# EAGLE design Board_v2_5 (EAGLE 9.6.2)
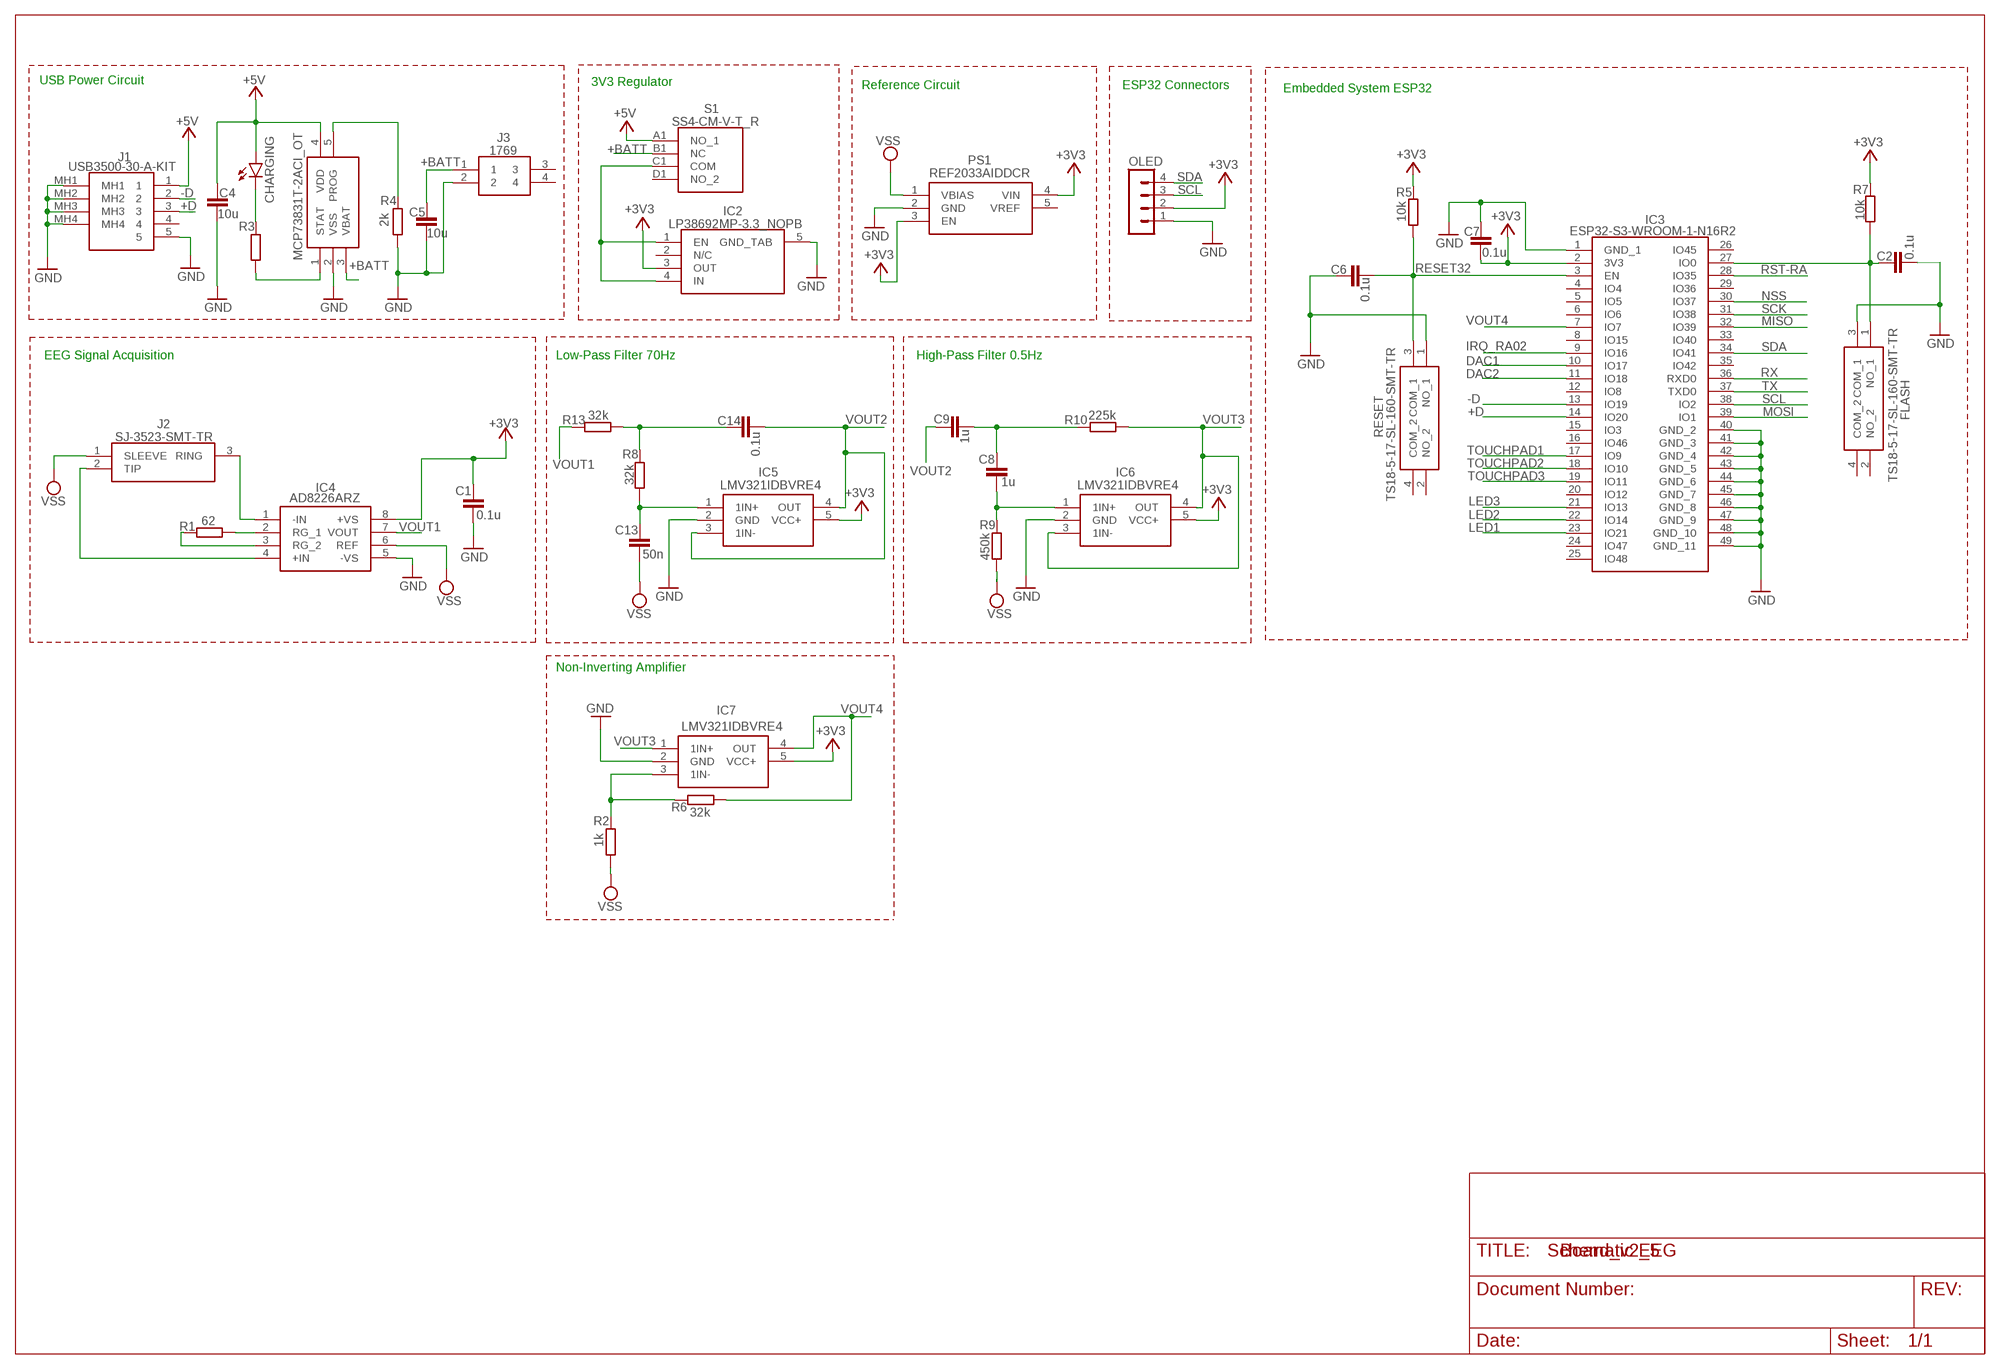
[diagram p0: schematic, sheet 1]

## Parts
C1  0.1u  C-EUC0805  [C0805]
C2  0.1u  C-EUC0805  [C0805]
C4  10u  C-EUC0805  [C0805]
C5  10u  C-EUC0805  [C0805]
C6  0.1u  C-EUC0805  [C0805]
C7  0.1u  C-EUC0805  [C0805]
C8  1u  C-EUC0805  [C0805]
C9  1u  C-EUC0805  [C0805]
C13  50n  C-EUC0805  [C0805]
C14  0.1u  C-EUC0805  [C0805]
CHARGING  LEDCHIP-LED0805  [CHIP-LED0805]
FLASH  TS18-5-17-SL-160-SMT-TR  [TS18517SL160SMTTR]
IC1  MCP73831T-2ACI_OT  [SOT95P270X145-5N]
IC2  LP38692MP-3.3_NOPB  [SOT150P700X180-5N]
IC3  ESP32-S3-WROOM-1-N16R2  [ESP32S3WROOM1N16R2]
IC4  AD8226ARZ  [SOIC127P600X175-8N]
IC5  LMV321IDBVRE4  [SOT95P280X145-5N]
IC6  LMV321IDBVRE4  [SOT95P280X145-5N]
IC7  LMV321IDBVRE4  [SOT95P280X145-5N]
J1  USB3500-30-A-KIT  [USB350030AKIT]
J2  SJ-3523-SMT-TR  [SJ3523SMTTR]
J3  1769  [1769]
OLED  MA04-1  [MA04-1]
PS1  REF2033AIDDCR  [SOT95P280X110-5N]
R1  62  R-EU_R0805  [R0805]
R2  1k  R-EU_R0805  [R0805]
R3  220  R-EU_R0805  [R0805]
R4  2k  R-EU_R0805  [R0805]
R5  10k  R-EU_R0805  [R0805]
R6  32k  R-EU_R0805  [R0805]
R7  10k  R-EU_R0805  [R0805]
R8  32k  R-EU_R0805  [R0805]
R9  450k  R-EU_R0805  [R0805]
R10  225k  R-EU_R0805  [R0805]
R13  32k  R-EU_R0805  [R0805]
RESET  TS18-5-17-SL-160-SMT-TR  [TS18517SL160SMTTR]
S1  SS4-CM-V-T_R  [SS4CMVTR]

## Nets
+3V3: C1.1 C7.2 IC2.3(OUT) IC3.2(3V3) IC4.8(+VS) IC5.5(VCC+) IC6.5(VCC+) IC7.5(VCC+) OLED.2 PS1.3(EN) PS1.4(VIN) R5.2 R7.2
+5V: J1.1 S1.A1(NO_1)
+BATT: C5.2 IC1.3(VBAT) J3.1 S1.B1(NC)
+D: IC3.14(IO20) J1.3
-D: IC3.13(IO19) J1.2
DAC1: IC3.10(IO17)
DAC2: IC3.11(IO18)
GND: C1.2 C2.2 C4.1 C5.1 C6.1 C7.1 FLASH.3(COM_1) IC1.2(VSS) IC2.5(GND_TAB) IC3.1(GND_1) IC3.40(GND_2) IC3.41(GND_3) IC3.42(GND_4) IC3.43(GND_5) IC3.44(GND_6) IC3.45(GND_7) IC3.46(GND_8) IC3.47(GND_9) IC3.48(GND_10) IC3.49(GND_11) IC4.5(-VS) IC5.2(GND) IC6.2(GND) IC7.2(GND) J1.5 J1.MH1 J1.MH2 J1.MH3 J1.MH4 J3.2 OLED.1 PS1.2(GND) R4.1 RESET.1(NO_1)
IRQ_RA02: IC3.9(IO16)
LED1: IC3.23(IO21)
LED2: IC3.22(IO14)
LED3: IC3.21(IO13)
MISO: IC3.32(IO39)
MOSI: IC3.39(IO1)
N$1: IC4.2(RG_1) R1.2
N$2: IC4.3(RG_2) R1.1
N$3: IC4.1(-IN) J2.3(RING)
N$4: IC4.4(+IN) J2.2(TIP)
N$5: C8.2 IC6.1(1IN+) R9.2
N$6: IC1.1(STAT) R3.1
N$7: IC1.5(PROG) R4.2
N$8: CHARGING.C R3.2
N$9: C8.1 C9.2 R10.1
N$10: C2.1 FLASH.1(NO_1) IC3.27(IO0) R7.1
N$11: C13.1 IC5.1(1IN+) R8.1
N$13: IC2.1(EN) IC2.4(IN) S1.C1(COM)
N$14: IC7.3(1IN-) R2.2 R6.2
N$15: C4.2 CHARGING.A IC1.4(VDD)
N$17: C14.1 R8.2 R13.2
NSS: IC3.30(IO37)
RESET32: C6.2 IC3.3(EN) R5.1 RESET.3(COM_1)
RST-RA: IC3.28(IO35)
RX: IC3.36(RXD0)
SCK: IC3.31(IO38)
SCL: IC3.38(IO2) OLED.3
SDA: IC3.34(IO41) OLED.4
TOUCHPAD1: IC3.17(IO9)
TOUCHPAD2: IC3.18(IO10)
TOUCHPAD3: IC3.19(IO11)
TX: IC3.37(TXD0)
VOUT1: IC4.7(VOUT) R13.1
VOUT2: C9.1 C14.2 IC5.3(1IN-) IC5.4(OUT)
VOUT3: IC6.3(1IN-) IC6.4(OUT) IC7.1(1IN+) R10.2
VOUT4: IC3.7(IO7) IC7.4(OUT) R6.1
VSS: C13.2 IC4.6(REF) J2.1(SLEEVE) PS1.1(VBIAS) R2.1 R9.1
Unconnected: FLASH.2(NO_2) FLASH.4(COM_2) IC2.2(N/C) IC3.4(IO4) IC3.5(IO5) IC3.6(IO6) IC3.8(IO15) IC3.12(IO8) IC3.15(IO3) IC3.16(IO46) IC3.20(IO12) IC3.24(IO47) IC3.25(IO48) IC3.26(IO45) IC3.29(IO36) IC3.33(IO40) IC3.35(IO42) J1.4 J3.3 J3.4 PS1.5(VREF) RESET.2(NO_2) RESET.4(COM_2) S1.D1(NO_2)

## Notes on the sheet
- USB Power Circuit | 3V3 Regulator
- Reference Circuit | ESP32 Connectors | Embedded System ESP32
- EEG Signal Acquisition | Low-Pass Filter 70Hz | High-Pass Filter 0.5Hz
- Non-Inverting Amplifier
- Schematic EEG

## Library data of the parts
C1 C2 C4-C9 C13 C14 = rcl:C-EU: CAPACITOR, European symbol; SPICEPREFIX: C
CHARGING = led:LED: LED OSRAM: - CHIPLED LG R971, LG N971, LY N971, LG Q971, LY Q971, LO R971, LY R971 LH N974, LH R974 LS Q976, LO Q976, LY Q976 LO Q996 - Hyper CHIPLED LW Q18S LB Q993, LB Q99A, LB R99A - SideLED LS A670, LO A670, LY A670, LG A670, LP A670 LB A673, LV A673, LT A673, LW A673 LH A674 LY A675 LS A676, LA A676, LO A676, LY A676, LW A676 LS A679, LY A679, LG A679 - Hyper Micro SIDELED® LS Y876, LA Y876, LO Y876, LY Y876 LT Y87S - SmartLED LW L88C, LW L88S LB L89C, LB L89S, LG L890 LS L89K, LO L89K, LY L89K LS L896, LA L896, LO L896, LY L896 - TOPLED LS T670, LO T670, LY T670, LG T670, LP T670 LSG T670, LSP T670, LSY T670, LOP T670, LYG T670 LG T671, LOG T671, LSG T671 LB T673, LV T673, LT T673, LW T673 LH T674 LS T676, LA T676, LO T676, LY T676, LB T676, LH T676, LSB T676, LW T676 LB T67C, LV T67C, LT T67C, LS T67K, LO T67K, LY T67K, LW E67C LS E67B, LA E67B, LO E67B, LY E67B, LB E67C, LV E67C, LT E67C LW T67C LS T679, LY T679, LG T679 LS T770, LO T770, LY T770, LG T770, LP T770 LB T773, LV T773, LT T773, LW T773 LH T774 LS E675, LA E675, LY E675, LS T675 LS T776, LA T776, LO T776, LY T776, LB T776 LHGB T686 LT T68C, LB T68C - Hyper Mini TOPLED® LB M676 - Mini TOPLED Santana® LG M470 LS M47K, LO M47K, LY M47K Source: http://www.osram.convergy.de LUXEON: - LUMILED® LXK2-PW12-R00, LXK2-PW12-S00, LXK2-PW14-U00, LXK2-PW14-V00 LXK2-PM12-R00, LXK2-PM12-S00, LXK2-PM14-U00 LXK2-PE12-Q00, LXK2-PE12-R00, LXK2-PE12-S00, LXK2-PE14-T00, LXK2-PE14-U00 LXK2-PB12-K00, LXK2-PB12-L00, LXK2-PB12-M00, LXK2-PB14-N00, LXK2-PB14-P00, LXK2-PB14-Q00 LXK2-PR12-L00, LXK2-PR12-M00, LXK2-PR14-Q00, LXK2-PR14-R00 LXK2-PD12-Q00, LXK2-PD12-R00, LXK2-PD12-S00 LXK2-PH12-R00, LXK2-PH12-S00 LXK2-PL12-P00, LXK2-PL12-Q00, LXK2-PL12-R00 Source: www.luxeon.com KINGBRIGHT: KA-3528ASYC Source: www.kingbright.com
FLASH RESET = TS18-5-17-SL-160-SMT-TR:TS18-5-17-SL-160-SMT-TR: 5 x 5 mm, 1.7 mm Actuator Height, 160 gf, Silver, Surface Mount, TR, SPST, Tactile Switch Source: Datasheet <https://www.sameskydevices.com/product/resource/supplyframepdf/ts18.pdf>; DESCRIPTION: 5 x 5 mm, 1.7 mm Actuator Height, 160 gf, Silver, Surface Mount, TR, SPST, Tactile Switch; HEIGHT: 1.8mm; MANUFACTURER_NAME: Same Sky; MANUFACTURER_PART_NUMBER: TS18-5-17-SL-160-SMT-TR; MOUSER_PART_NUMBER: 179-TS18517SL160SMTT; MOUSER_PRICE-STOCK: https://www.mouser.co.uk/ProductDetail/CUI-Devices/TS18-5-17-SL-160-SMT-TR?qs=tlsG%2FOw5FFhWy38y3t272A%3D%3D
IC1 = MCP73831T-2ACI_OT:MCP73831T-2ACI_OT: Li-Ion Charge Controller 4.2V SOT23-5 Source: Datasheet <http://ww1.microchip.com/downloads/en/DeviceDoc/20001984g.pdf>; ARROW_PART_NUMBER: MCP73831T-2ACI/OT; ARROW_PRICE-STOCK: https://www.arrow.com/en/products/mcp73831t-2aciot/microchip-technology?utm_currency=USD&region=nac; DESCRIPTION: Li-Ion Charge Controller 4.2V SOT23-5; HEIGHT: 1.45mm; MANUFACTURER_NAME: Microchip; MANUFACTURER_PART_NUMBER: MCP73831T-2ACI/OT; MOUSER_PART_NUMBER: 579-MCP73831T-2ACIOT; MOUSER_PRICE-STOCK: https://www.mouser.co.uk/ProductDetail/Microchip-Technology/MCP73831T-2ACI-OT?qs=yUQqVecv4qvbBQBGbHx0Mw%3D%3D
IC2 = LP38692MP-3.3_NOPB:LP38692MP-3.3_NOPB: LP38692MP-3.3/NOPB, Low Dropout Voltage Regulator, 1A, 3.3 V +/-2.5%, 2.7 10 Vin, 5-Pin SOT-223 Source: Datasheet <http://www.ti.com/lit/ds/symlink/lp38692.pdf>; DESCRIPTION: LP38692MP-3.3/NOPB, Low Dropout Voltage Regulator, 1A, 3.3 V +/-2.5%, 2.7 10 Vin, 5-Pin SOT-223; HEIGHT: 1.8mm; MANUFACTURER_NAME: Texas Instruments; MANUFACTURER_PART_NUMBER: LP38692MP-3.3/NOPB; MOUSER_PART_NUMBER: 926-LP38692MP3.3NOPB; MOUSER_PRICE-STOCK: https://www.mouser.co.uk/ProductDetail/Texas-Instruments/LP38692MP-3.3-NOPB?qs=1FNqv8aZn1TpKuOP2NKBdg%3D%3D
IC3 = ESP32-S3-WROOM-1-N16R2:ESP32-S3-WROOM-1-N16R2: Bluetooth, WiFi 802.11b/g/n, Bluetooth v5.0 Transceiver Module 2.4GHz PCB Trace Surface Mount , 3V ~ 3.6V , 95mA ~ 97mA , -40C ~ 85C (TA) Source: Datasheet <https://www.espressif.com/sites/default/files/documentation/esp32-s3-wroom-1_wroom-1u_datasheet_en.pdf>; DESCRIPTION: Bluetooth, WiFi 802.11b/g/n, Bluetooth v5.0 Transceiver Module 2.4GHz PCB Trace Surface Mount , 3V ~ 3.6V , 95mA ~ 97mA , -40C ~ 85C (TA); HEIGHT: 3.25mm; MANUFACTURER_NAME: Espressif Systems; MANUFACTURER_PART_NUMBER: ESP32-S3-WROOM-1-N16R2; MOUSER_PART_NUMBER: 356-ESP32S3WRM1N16R2; MOUSER_PRICE-STOCK: https://www.mouser.co.uk/ProductDetail/Espressif-Systems/ESP32-S3-WROOM-1-N16R2?qs=Li%252BoUPsLEnvy1bxV65eH%2Fw%3D%3D
IC4 = AD8226ARZ:AD8226ARZ: Wide Supply Range, Rail-to-Rail Output Instrumentation Amplifier Source: Datasheet <http://componentsearchengine.com/Datasheets/3/AD8226ARZ.pdf>; DESCRIPTION: Wide Supply Range, Rail-to-Rail Output Instrumentation Amplifier; HEIGHT: 1.75mm; MANUFACTURER_NAME: Analog Devices; MANUFACTURER_PART_NUMBER: AD8226ARZ; MOUSER_PART_NUMBER: 584-AD8226ARZ; MOUSER_PRICE-STOCK: https://www.mouser.co.uk/ProductDetail/Analog-Devices/AD8226ARZ?qs=%2FtpEQrCGXCzihJADRPlhCg%3D%3D
IC5-IC7 = LMV321IDBVRE4:LMV321IDBVRE4: OP Amp Single GP R-R O/P 5.5V 5-Pin SOT-23 T/R Source: Datasheet <https://www.ti.com/lit/ds/symlink/lmv321.pdf?ts=1639294341048&ref_url=https%3A%2F%2Fwww.ti.com%2Fstore%2Fti%2Fen%2Fp%2Fproduct%2F%3Fp%3DLMV321IDBVR>; DESCRIPTION: OP Amp Single GP R-R O/P 5.5V 5-Pin SOT-23 T/R; HEIGHT: 1.45mm; MANUFACTURER_NAME: Texas Instruments; MANUFACTURER_PART_NUMBER: LMV321IDBVRE4; MOUSER_PART_NUMBER: 595-LMV321IDBVRE4; MOUSER_PRICE-STOCK: https://www.mouser.co.uk/ProductDetail/Texas-Instruments/LMV321IDBVRE4?qs=yhNIDeTE%252BcaI6cu5FHph6A%3D%3D
J1 = USB3500-30-A-KIT:USB3500-30-A-KIT: USB Connectors Micro B Skt, Mid Mount-SMT, R/A, 30u", With Peg, T&R, IP67 + USBTJ-02 Gasket Source: Datasheet <https://gct.co/files/drawings/usb3500.pdf>; DESCRIPTION: USB Connectors Micro B Skt, Mid Mount-SMT, R/A, 30u", With Peg, T&R, IP67 + USBTJ-02 Gasket; HEIGHT: 2.8mm; MANUFACTURER_NAME: GCT (GLOBAL CONNECTOR TECHNOLOGY); MANUFACTURER_PART_NUMBER: USB3500-30-A-KIT; MOUSER_PART_NUMBER: 640-USB3500-30-A-KIT; MOUSER_PRICE-STOCK: https://www.mouser.co.uk/ProductDetail/GCT/USB3500-30-A-KIT?qs=KUoIvG%2F9IlZmD2kH2DfgYg%3D%3D
J2 = SJ-3523-SMT-TR:SJ-3523-SMT-TR: 3.5 mm, Stereo, Right Angle, Surface Mount (SMT), 3 Conductors, 0 Internal Switches, Audio Jack Connector Source: Datasheet <https://www.sameskydevices.com/product/resource/supplyframepdf/sj-352x-smt.pdf>; DESCRIPTION: 3.5 mm, Stereo, Right Angle, Surface Mount (SMT), 3 Conductors, 0 Internal Switches, Audio Jack Connector; HEIGHT: 5.2mm; MANUFACTURER_NAME: Same Sky; MANUFACTURER_PART_NUMBER: SJ-3523-SMT-TR; MOUSER_PART_NUMBER: 490-SJ-3523-SMT-TR; MOUSER_PRICE-STOCK: https://www.mouser.co.uk/ProductDetail/CUI-Devices/SJ-3523-SMT-TR?qs=WyjlAZoYn51zOHzJ3r4ZRA%3D%3D
J3 = 1769:1769: Adafruit Accessories JST-PH 2-pin SMT Right Angle Connect Source: Datasheet <https://cdn-shop.adafruit.com/datasheets/17311.pdf>; ARROW_PART_NUMBER: 1769; ARROW_PRICE-STOCK: https://www.arrow.com/en/products/1769/adafruit-industries?utm_currency=USD&region=nac; DESCRIPTION: Adafruit Accessories JST-PH 2-pin SMT Right Angle Connect; HEIGHT: 5.5mm; MANUFACTURER_NAME: Adafruit; MANUFACTURER_PART_NUMBER: 1769; MOUSER_PART_NUMBER: 485-1769; MOUSER_PRICE-STOCK: https://www.mouser.co.uk/ProductDetail/Adafruit/1769?qs=GURawfaeGuBbgoGtf2XstA%3D%3D
OLED = con-lstb:MA04-1: PIN HEADER; OC_FARNELL: unknown; OC_NEWARK: unknown
PS1 = REF2033AIDDCR:REF2033AIDDCR: Low-Drift, Low-Power, Dual-Output Vref and Vref/2 Voltage Reference Source: Datasheet <http://www.ti.com/lit/ds/symlink/ref2033.pdf>; DESCRIPTION: Low-Drift, Low-Power, Dual-Output Vref and Vref/2 Voltage Reference; HEIGHT: 1.1mm; MANUFACTURER_NAME: Texas Instruments; MANUFACTURER_PART_NUMBER: REF2033AIDDCR; MOUSER_PART_NUMBER: 595-REF2033AIDDCR; MOUSER_PRICE-STOCK: https://www.mouser.co.uk/ProductDetail/Texas-Instruments/REF2033AIDDCR?qs=7z%252BmIopC6%2FKHHOBVNaL7UQ%3D%3D
R1-R10 R13 = rcl:R-EU_: RESISTOR, European symbol; SPICEPREFIX: R
S1 = SS4-CM-V-T_R:SS4-CM-V-T_R: Slide Switches Slide Type 1P3T (2.0mm height) Source: Datasheet <https://componentsearchengine.com/Datasheets/1/SS4-CM-V-T_R.pdf>; DESCRIPTION: Slide Switches Slide Type 1P3T (2.0mm height); HEIGHT: 2mm; MANUFACTURER_NAME: Diptronics; MANUFACTURER_PART_NUMBER: SS4-CM-V-T/R; MOUSER_PART_NUMBER: 113-SS4CMVTR; MOUSER_PRICE-STOCK: https://www.mouser.co.uk/ProductDetail/Diptronics/SS4-CM-V-T-R?qs=MLItCLRbWswqNEU%2F6grMKg%3D%3D

## Net classes
0 default: clearance 0.205 mm

## Board
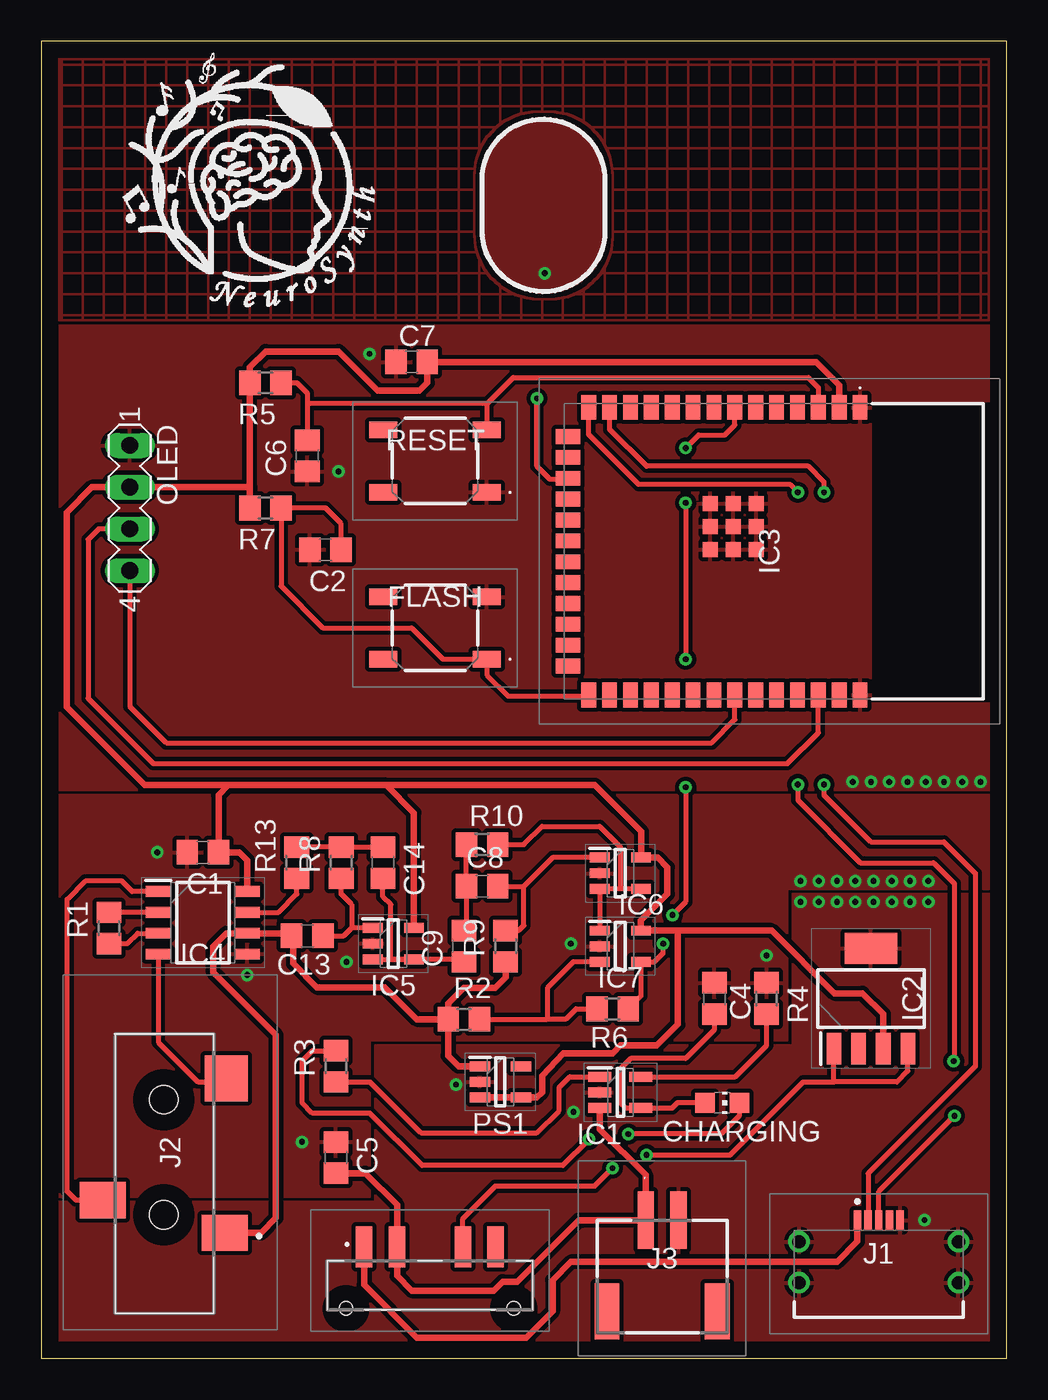
[diagram p1: board, top side]
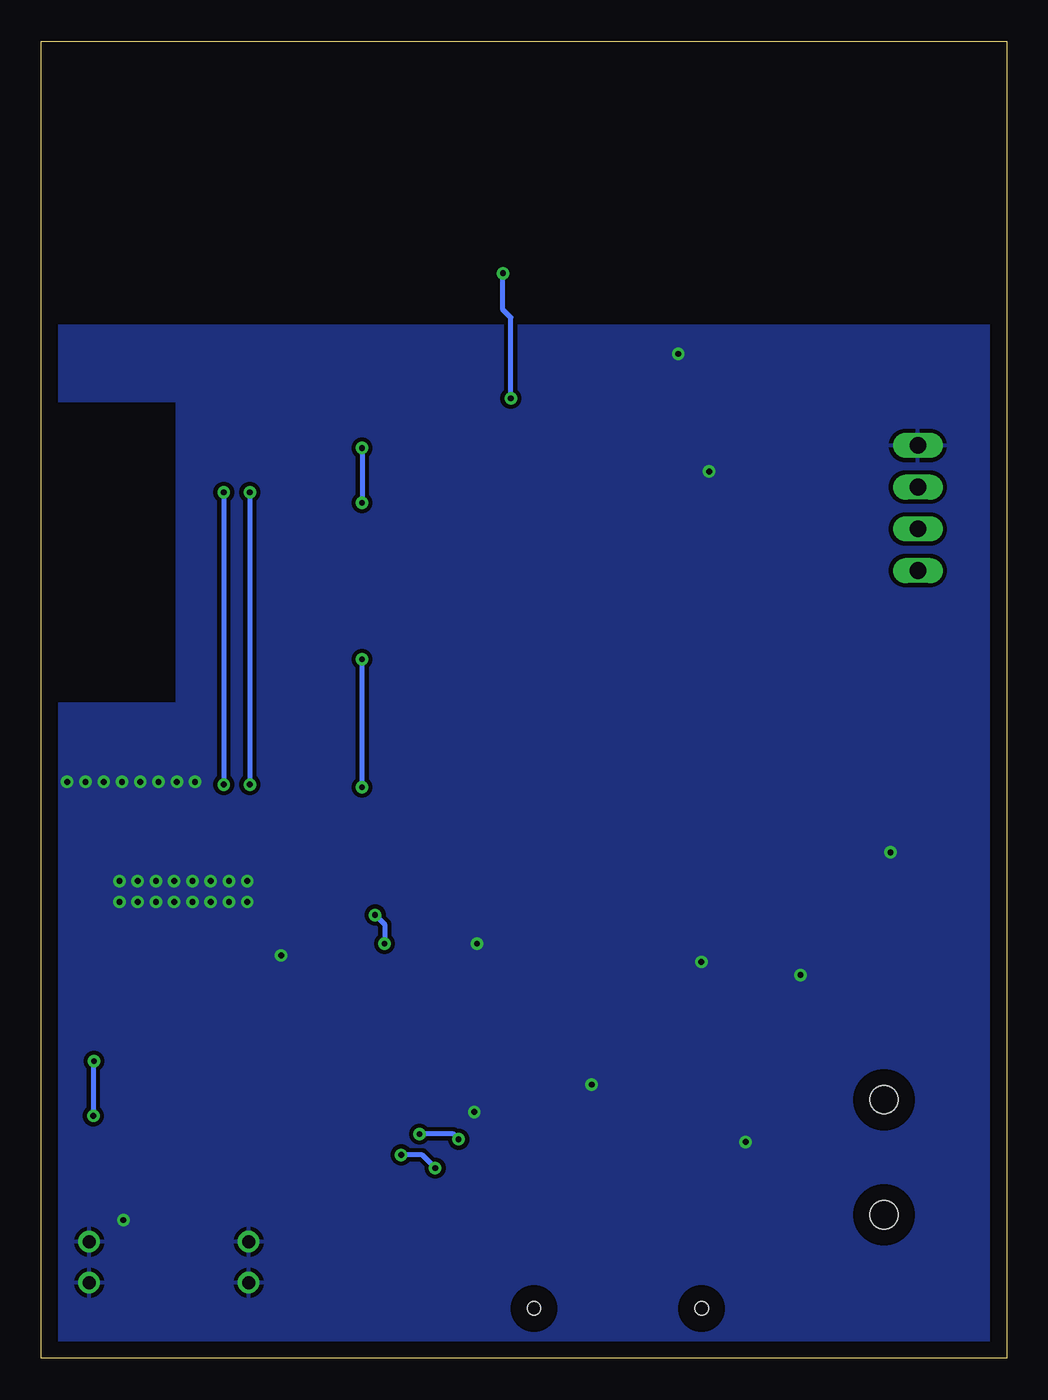
[diagram p2: board, bottom side, seen from below]

Size 58.74 x 80.17 mm. Coordinates in mm from the lower left corner, seen from the top.
Outline: 0,0 58.73,0 58.73,1.1 58.74,10.79 58.74,80.17 58.42,80.17 58.41,80.17 0,80.17 0,0
Copper layers (1*16): Top 0.035mm / dielectric 1.5mm / Bottom 0.035mm
Design rules "Board_v1_4": minimum track width 6mil, minimum drill 0.35mm, track to track 0.205mm, track to pad 0.205mm, pad to pad 0.205mm, via to via 0.205mm, smd to smd 6mil, copper to edge 40mil, drill to drill 6mil, minimum pad ring 10mil, minimum via ring 8mil, stop-mask expansion 4mil, vias tented up to drill 0mil, thermal gap 10mil

### Footprints (pad centres in the part's own frame; a part is rotated, then mirrored left to right if it is on the bottom)
C0805 = smd 1.3 x 1.5: 1 -0.95,0; 2 0.95,0
CHIP-LED0805 = smd 1.2 x 1.2: A 0,-1.05; C 0,1.05
TS18517SL160SMTTR = smd 1.7 x 1: 1 -3.15,1.9; 2 3.15,1.9; 3 -3.15,-1.9; 4 3.15,-1.9
SOT95P270X145-5N = smd 1.4 x 0.6: 1 -1.25,0.95; 2 -1.25,0; 3 -1.25,-0.95; 4 1.25,-0.95; 5 1.25,0.95
SOT150P700X180-5N = smd 1.9 x 0.9: 1 -3.05,2.25; 2 -3.05,0.75; 3 -3.05,-0.75; 4 -3.05,-2.25 | smd 1.9 x 3.2: 5 3.05,0
ESP32S3WROOM1N16R2 = smd 1.5 x 0.9: 1 -8.75,5.26; 2 -8.75,3.99; 3 -8.75,2.72; 4 -8.75,1.45; 5 -8.75,0.18; 6 -8.75,-1.09; 7 -8.75,-2.36; 8 -8.75,-3.63; 9 -8.75,-4.9; 10 -8.75,-6.17; 11 -8.75,-7.44; 12 -8.75,-8.71; 13 -8.75,-9.98; 14 -8.75,-11.25; 27 8.75,-11.25; 28 8.75,-9.98; 29 8.75,-8.71; 30 8.75,-7.44; 31 8.75,-6.17; 32 8.75,-4.9; 33 8.75,-3.63; 34 8.75,-2.36; 35 8.75,-1.09; 36 8.75,0.18; 37 8.75,1.45; 38 8.75,2.72; 39 8.75,3.99; 40 8.75,5.26 | smd 0.9 x 1.5: 15 -6.985,-12.5; 16 -5.715,-12.5; 17 -4.445,-12.5; 18 -3.175,-12.5; 19 -1.905,-12.5; 20 -0.635,-12.5; 21 0.635,-12.5; 22 1.905,-12.5; 23 3.175,-12.5; 24 4.445,-12.5; 25 5.715,-12.5; 26 6.985,-12.5 | smd 0.9 x 0.9: 41 -1.5,-2.46; 42 -2.9,-1.06; 43 -2.9,-2.46; 44 -2.9,-3.86; 45 -1.5,-3.86; 46 -0.1,-3.86; 47 -0.1,-2.46; 48 -0.1,-1.06; 49 -1.5,-1.06
SOIC127P600X175-8N = smd 1.525 x 0.65: 1 -2.712,1.905; 2 -2.712,0.635; 3 -2.712,-0.635; 4 -2.712,-1.905; 5 2.712,-1.905; 6 2.712,-0.635; 7 2.712,0.635; 8 2.712,1.905
SOT95P280X145-5N = smd 1.2 x 0.6: 1 -1.25,0.95; 2 -1.25,0; 3 -1.25,-0.95; 4 1.25,-0.95; 5 1.25,0.95
USB350030AKIT = smd 0.45 x 1.2: 1 -1.3,3.8; 2 -0.65,3.8; 3 0,3.8; 4 0.65,3.8; 5 1.3,3.8 | drill 0.8 pad 1.2: MH1 -4.85,2.5; MH2 4.85,2.5; MH3 -4.85,0; MH4 4.85,0
SJ3523SMTTR = smd 2.2 x 2.8: 1 2.4,-3.7; 3 4.4,3.7 | smd 2.8 x 2.6: 2 11.8,-3.8 | hole 1.7: 3.5,0; 10.5,0
1769 = smd 1 x 3.5: 1 -1,0; 2 1,0 | smd 1.5 x 3.4: 3 -3.35,-5.55; 4 3.35,-5.55
MA04-1 = drill 1.016 long: 1 -3.81,0; 2 -1.27,0; 3 1.27,0; 4 3.81,0
SOT95P280X110-5N = smd 1.25 x 0.6: 1 -1.25,0.95; 2 -1.25,0; 3 -1.25,-0.95; 4 1.25,-0.95; 5 1.25,0.95
R0805 = smd 1.3 x 1.5: 1 -0.95,0; 2 0.95,0
SS4CMVTR = smd 1 x 2.5: A1 -4,2.35; B1 -2,2.35; C1 2,2.35; D1 4,2.35 | hole 0.8: -5.1,-1.4; 5.1,-1.4

### Placement (x,y rotation side)
C1  9.84,30.8 180 top
C2  17.3,49.21 180 top
C4  40.96,21.91 270 top
C5  17.94,12.22 270 top
C6  16.19,54.93 90 top
C7  22.54,60.64 0 top
C8  26.83,28.73 0 top
C9  25.72,25.08 90 top
C13  16.19,25.72 180 top
C14  20.8,30.16 270 top
CHARGING  41.43,15.56 270 top
FLASH  23.97,44.45 180 top
IC1  35.24,16.19 0 top
IC2  50.48,21.91 90 top
IC3  44.56,49.12 270 top
IC4  9.84,26.51 0 top
IC5  21.43,25.24 0 top
IC6  35.24,29.53 0 top
IC7  35.24,25.08 0 top
J1  50.96,4.6 0 top
J2  7.46,5.24 90 top
J3  37.78,8.41 0 top
OLED  5.4,51.75 270 top
PS1  27.94,16.83 0 top
R1  4.13,26.19 90 top
R2  25.72,20.64 0 top
R3  17.94,17.78 90 top
R4  44.13,21.91 270 top
R5  13.65,59.37 180 top
R6  34.77,21.27 180 top
R7  13.65,51.75 180 top
R8  18.26,30.16 90 top
R9  28.26,25.08 90 top
R10  26.83,31.27 0 top
R13  15.56,30.16 90 top
RESET  23.97,54.61 180 top
S1  23.65,4.45 0 top

### Tracks (layer width: path | path; a pad name or v marks a point on that pad's centre or on a via)
+3V3
  Top 0.406: 21,34.88 33.7,34.88 36.51,32.07 36.51,30.5 IC6.5 37.5,30.48 38.1,29.88 38.1,28.26 36.49,26.65 IC7.5 38.73,26.04 | 38.73,26.04 38.73,20.32 37.47,19.05 35.24,19.05 34.77,18.58 31.75,18.58 30.48,17.21 30.48,16.19 30.16,15.88 29.21,15.88 PS1.4 PS1.3 | 12.7,53.02 OLED.2 3.09,53.02 1.56,51.49 1.56,39.64 6.31,34.88 11.39,34.88 | R7.2 12.7,53.02 | IC5.5 22.68,33.2 21,34.88 | 12.7,53.02 R5.2 12.7,60.33 13.65,61.28 18.1,61.28 20.48,58.9 23.02,58.9 23.49,59.37 C7.2 47.15,60.64 48.55,59.24 IC3.2 | IC4.8 12.55,30.31 12.06,30.8 C1.1 10.79,34.29 11.39,34.88 | 21,34.88 11.39,34.88 | 38.73,26.04 44.45,26.04 48.26,22.22 49.96,22.22 51.23,20.95 IC2.3
+5V
  Top 0.406: S1.A1 19.65,4.48 22.86,1.27 29.53,1.27 31.11,2.86 31.11,4.76 32.23,5.87 48.42,5.87 49.66,7.11 J1.1
+BATT
  Top 0.406: C5.2 19.71,11.27 21.65,9.34 S1.B1 21.65,5.02 22.54,4.13 27.55,4.13 28.08,4.66 28.95,4.66 32.7,8.41 33.02,8.41 J3.1 36.78,11.16 33.99,13.95 IC1.3
+D  (via drill 0.35)
  Top 0.305: v55.51,18.1 55.56,18.14 55.56,28.89 54.29,30.16 49.85,30.16 46.04,33.97 v46.04,34.92 | J1.3 50.96,10.16 v55.56,14.76 | v46.04,52.7 45.56,53.18 36.35,53.18 33.31,56.22 IC3.14
  Bottom 0.305: v55.56,14.76 55.56,18.05 v55.51,18.1 | v46.04,52.7 v46.04,34.92
-D  (via drill 0.35)
  Top 0.305: J1.2 50.31,11.26 56.83,17.78 56.83,29.53 54.93,31.43 50.48,31.43 47.62,34.29 v47.62,34.92 | v47.62,52.7 47.62,53.34 46.67,54.29 36.83,54.29 34.58,56.54 IC3.13
  Bottom 0.305: v47.62,52.7 v47.62,34.92
GND  (via drill 0.35)
  other vias: 46.2,27.78 46.2,29.05 47.31,29.05 47.31,27.78 48.42,29.05 48.42,27.78 49.53,27.78 49.53,29.05 50.64,29.05 50.64,27.78 51.75,27.78 51.75,29.05 52.86,29.05 52.86,27.78 53.98,29.05 53.98,27.78 49.37,35.08 50.48,35.08 51.59,35.08 52.7,35.08 53.82,35.08 54.93,35.08 56.04,35.08 57.15,35.08 44.13,24.53 32.23,25.24 18.1,53.98 18.57,24.13 12.54,23.34 7.06,30.8 32.38,15 25.24,16.67 53.74,8.41 15.88,13.18 19.98,61.13
  pour Top (isolate 0.254): 58.42,28.26 45.72,28.26 45.72,19.05 20.32,19.05 20.32,9.53 0.64,9.53 0.64,0.32 58.42,0.32
  pour Top (isolate 0.254): 0.64,9.84 20,9.84 20,19.37 45.4,19.37 45.4,28.57 58.42,28.57 58.42,34.29 0.64,34.29
  pour Top (isolate 0.254): 58.42,34.61 58.42,39.85 50.48,39.85 50.48,58.26 58.42,58.26 58.42,62.87 0.64,62.87 0.64,34.61
  pour Bottom (isolate 0.254): 0,62.87 58.66,62.87 58.66,58.26 50.48,58.26 50.48,39.85 58.66,39.85 58.66,0.02 0,0.02
  pour Top (isolate 0.254, rank 2, hatched): 0.16,80.01 58.74,80.01 58.74,63.18 0.16,63.18
N$1
  Top 0.305: IC4.2 R1.2
N$2
  Top 0.305: R1.1 5.24,25.24 5.87,25.88 IC4.3
N$3
  Top 0.305: IC4.1 5.54,28.42 4.91,29.05 2.7,29.05 1.59,27.94 1.59,10.16 2.11,9.64 J2.3
N$4
  Top 0.305: IC4.4 7.13,19.24 9.54,16.84 11.06,16.84 J2.2
N$5
  Top 0.305: 29.37,28.73 31.11,30.48 IC6.1 | C8.2 29.37,28.73 | R9.2 29.05,26.03 29.37,26.35 29.37,28.73
N$6
  Top 0.305: R3.1 20,16.83 23.1,13.73 30.16,13.73 31.51,15.08 31.51,16.49 32.16,17.14 IC1.1
N$7
  Top 0.305: IC1.5 42.23,17.14 44.13,19.05 R4.2
N$8  (via drill 0.35)
  Top 0.305: v33.34,13.34 31.75,11.75 23.18,11.75 20,14.92 16.51,14.92 15.88,15.56 15.88,18.1 16.51,18.73 R3.2 | CHARGING.C 42.48,14.76 41.37,13.65 v35.72,13.65
  Bottom 0.305: v33.34,13.34 33.66,13.65 v35.72,13.65
N$9
  Top 0.305: R10.1 C8.1 25.88,26.19 C9.2
N$10
  Top 0.305: C2.1 18.25,50.8 17.3,51.75 R7.1 14.61,46.99 17.14,44.45 22.54,44.45 24.44,42.55 FLASH.1 27.12,41.6 28.41,40.3 33.25,40.3 IC3.27
N$11
  Top 0.305: R8.1 18.26,28.26 18.89,27.62 18.89,26.19 | C13.1 18.41,25.72 18.89,26.19 | IC5.1 18.89,26.19
N$13  (via drill 0.35)
  Top 0.305: 48.23,16.83 IC2.1 | S1.C1 25.65,8.51 27.62,10.48 33.66,10.48 v34.77,11.59 | v36.83,12.38 41.91,12.38 46.35,16.83 48.23,16.83 | 48.23,16.83 52.07,16.83 52.73,17.49 IC2.4
  Bottom 0.305: v34.77,11.59 35.56,12.38 v36.83,12.38
N$14
  Top 0.305: IC7.3 32.39,24.13 30.8,22.54 30.8,20.64 | R2.2 30.8,20.64 | 30.8,20.64 31.91,20.64 32.55,21.27 R6.2
N$15
  Top 0.305: CHARGING.A 38.71,15.56 38.4,15.24 IC1.4 35.56,15.24 35.24,15.56 35.24,17.62 35.88,18.26 39.21,18.26 40.96,20 C4.2
N$17
  Top 0.305: R13.2 16.19,31.11 R8.2 18.89,31.11 20.32,31.11 C14.1
RESET32
  Top 0.305: 16.19,58.1 27.12,58.1 RESET.3 27.12,58.08 28.73,59.69 46.67,59.69 47.28,59.08 IC3.3 | R5.1 15.56,59.37 16.19,58.74 16.19,58.1 | 16.19,58.1 C6.2
SCL
  Top 0.305: OLED.3 3.49,50.48 2.86,49.85 2.86,40.16 6.83,36.2 45.4,36.2 47.28,38.08 IC3.38
SDA
  Top 0.305: OLED.4 5.4,39.69 7.62,37.47 40.8,37.47 42.2,38.87 IC3.34
TOUCHPAD1  (via drill 0.35)
  Top 0.305: v30.16,58.42 30.16,54.29 30.96,53.5 32,53.5 IC3.17
  Bottom 0.305: v30.64,66.04 30.64,63.82 30.16,63.34 v30.16,58.42
  pour Top (isolate 0.254): 30.56,75.49 arc90 26.75,71.68 26.75,68.74 arc90 30.64,64.85 arc90 34.37,68.58 34.37,71.68 arc90
VOUT1
  Top 0.305: IC4.7 14.45,27.15 15.56,28.26 R13.1
VOUT2
  Top 0.305: IC5.4 25.56,24.29 C9.1 | IC5.4 21.27,24.29 21.27,27.62 20.8,28.1 C14.2 | IC5.3 IC5.4
VOUT3
  Top 0.305: R10.2 29.37,31.27 30.48,32.38 33.97,32.38 35.24,31.11 35.24,28.58 IC6.4 IC6.3 33.97,28.56 33.97,26.05 IC7.1
VOUT4  (via drill 0.35)
  Top 0.305: v39.21,34.77 39.21,27.78 v38.42,26.99 | v39.21,52.07 v39.21,42.55 | v39.21,55.4 40.01,56.2 41.59,56.2 42.2,56.81 IC3.7 | v37.84,25.24 37.84,24.67 37.31,24.13 IC7.4 36.49,22.05 R6.1
  Bottom 0.305: v38.42,26.99 37.84,26.41 v37.84,25.24 | v39.21,34.77 v39.21,42.55 | v39.21,55.4 v39.21,52.07
VSS
  Top 0.406: R9.1 28.26,23.18 27.62,22.55 25.72,22.55 24.77,21.59 R2.1 | PS1.1 25.4,17.78 24.77,18.41 R2.1 | J2.1 13.38,7.64 14.29,8.54 14.29,19.68 10.48,23.5 10.48,25.08 11.27,25.88 IC4.6 15.08,25.88 C13.2 15.34,25.62 15.34,24.03 16.78,22.59 20.9,22.59 22.86,20.64 R2.1

### Text on the board
200bmp: C:/Users/crist/OneDrive/Escritorio/logo.bmp